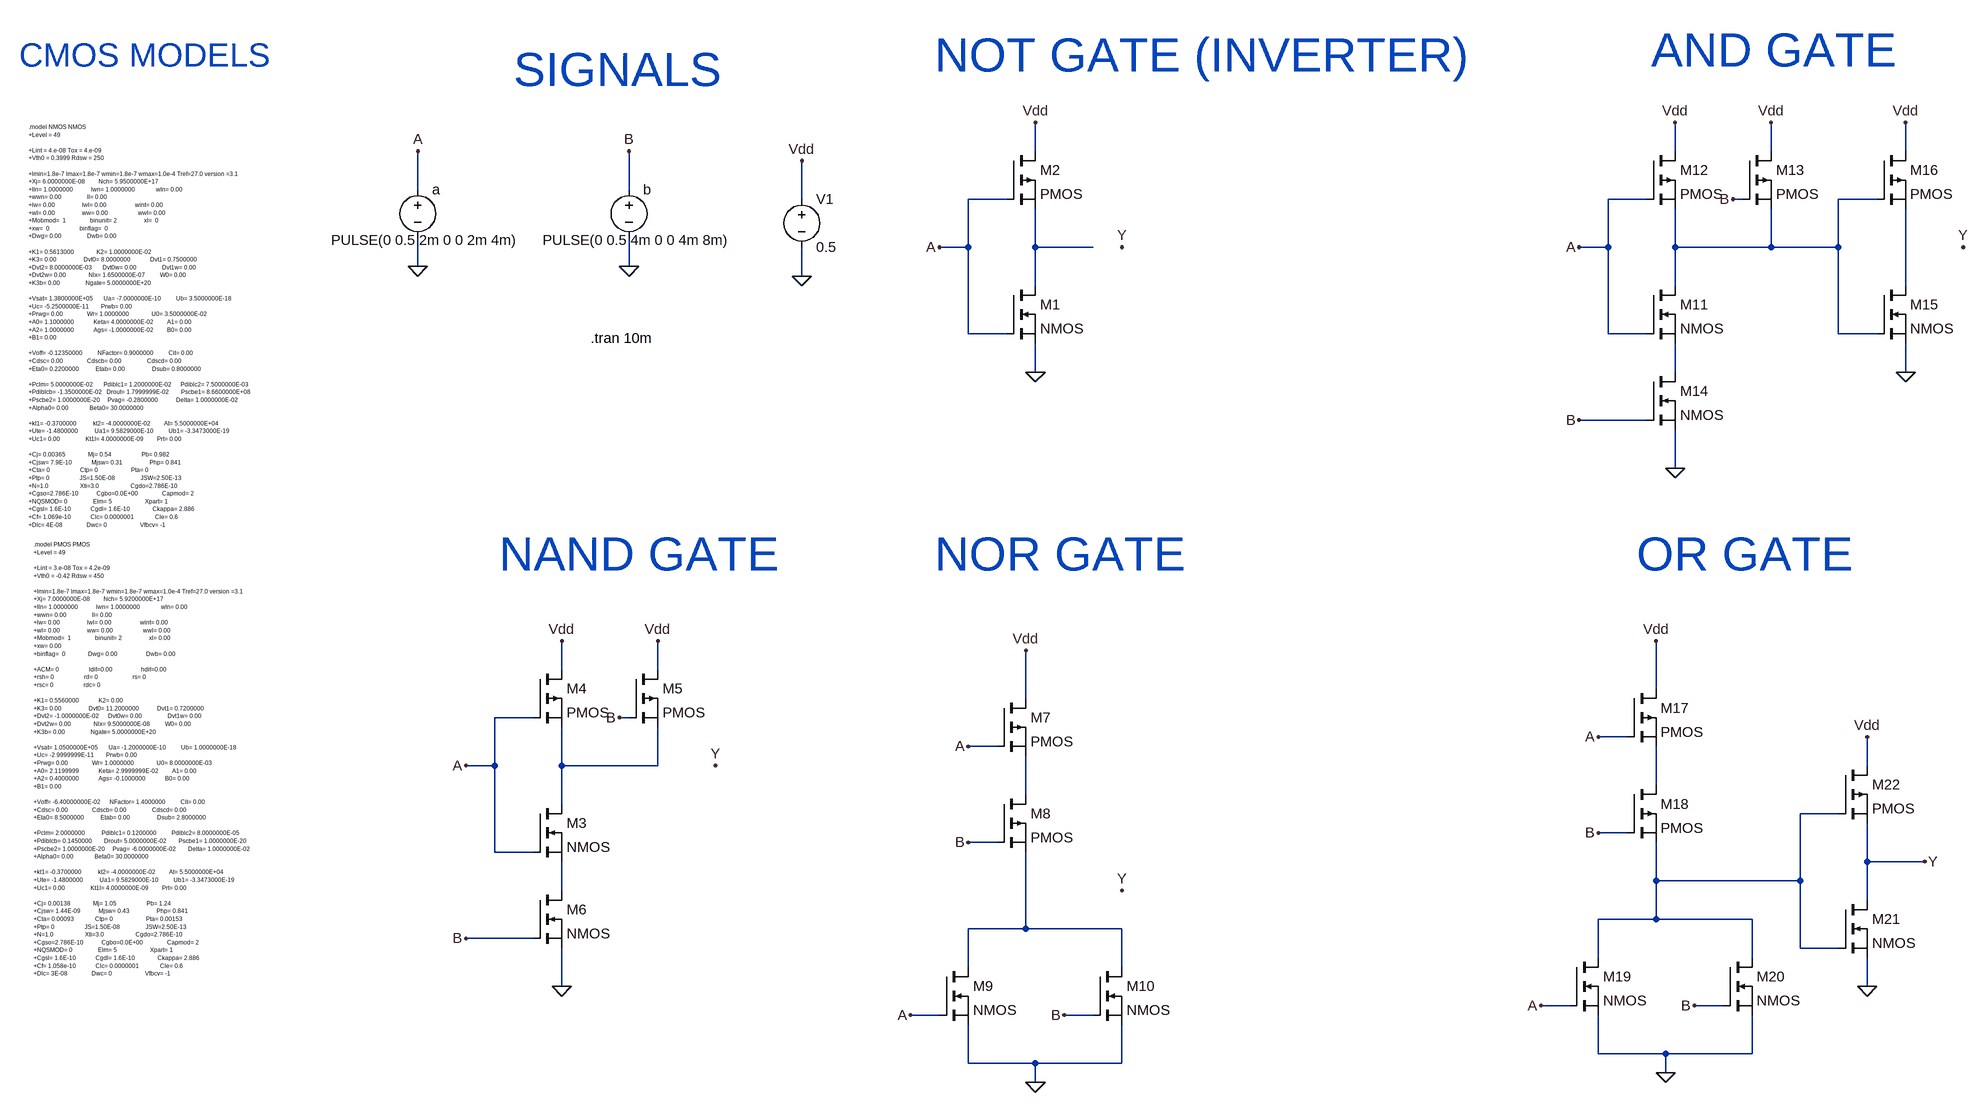
[diagram p0: schematic CMOS_Gates.asc]
CMOS_Gates.asc, the LTspice schematic file:
Version 4
SHEET 1 2392 1604
WIRE -560 -480 -560 -528
WIRE 528 -480 528 -528
WIRE 688 -480 688 -528
WIRE 912 -480 912 -528
WIRE -1696 -416 -1696 -480
WIRE -1344 -416 -1344 -480
WIRE -1056 -400 -1056 -464
WIRE -608 -400 -672 -400
WIRE 480 -400 416 -400
WIRE 640 -400 624 -400
WIRE 864 -400 800 -400
WIRE -672 -320 -672 -400
WIRE -672 -320 -720 -320
WIRE -560 -320 -560 -384
WIRE -464 -320 -560 -320
WIRE 416 -320 416 -400
WIRE 416 -320 368 -320
WIRE 528 -320 528 -384
WIRE 688 -320 688 -384
WIRE 688 -320 528 -320
WIRE 800 -320 800 -400
WIRE 800 -320 688 -320
WIRE -1696 -288 -1696 -336
WIRE -1344 -288 -1344 -336
WIRE -1056 -272 -1056 -320
WIRE -560 -256 -560 -320
WIRE 528 -256 528 -320
WIRE 912 -256 912 -384
WIRE -672 -176 -672 -320
WIRE -608 -176 -672 -176
WIRE 416 -176 416 -320
WIRE 480 -176 416 -176
WIRE 800 -176 800 -320
WIRE 864 -176 800 -176
WIRE -560 -112 -560 -160
WIRE 528 -112 528 -160
WIRE 912 -112 912 -160
WIRE 480 -32 368 -32
WIRE 528 48 528 -16
WIRE -1456 384 -1456 336
WIRE -1296 384 -1296 336
WIRE 496 416 496 336
WIRE -576 432 -576 352
WIRE -1504 464 -1568 464
WIRE -1344 464 -1360 464
WIRE 448 496 400 496
WIRE -624 512 -672 512
WIRE -1568 544 -1568 464
WIRE -1568 544 -1616 544
WIRE -1456 544 -1456 480
WIRE -1296 544 -1296 480
WIRE -1296 544 -1456 544
WIRE 848 544 848 496
WIRE 496 576 496 512
WIRE -576 592 -576 528
WIRE -1456 608 -1456 544
WIRE 800 624 736 624
WIRE 448 656 400 656
WIRE -624 672 -672 672
WIRE -1568 688 -1568 544
WIRE -1504 688 -1568 688
WIRE 848 704 848 640
WIRE 944 704 848 704
WIRE 496 736 496 672
WIRE 736 736 736 624
WIRE 736 736 496 736
WIRE -1456 752 -1456 704
WIRE 848 768 848 704
WIRE 496 800 496 736
WIRE 496 800 400 800
WIRE 656 800 496 800
WIRE -576 816 -576 688
WIRE -576 816 -672 816
WIRE -416 816 -576 816
WIRE -1504 832 -1616 832
WIRE 736 848 736 736
WIRE 800 848 736 848
WIRE 400 864 400 800
WIRE 656 864 656 800
WIRE -672 880 -672 816
WIRE -416 880 -416 816
WIRE -1456 912 -1456 848
WIRE 848 912 848 864
WIRE 352 944 304 944
WIRE 608 944 560 944
WIRE -720 960 -768 960
WIRE -464 960 -512 960
WIRE 400 1024 400 960
WIRE 512 1024 400 1024
WIRE 656 1024 656 960
WIRE 656 1024 512 1024
WIRE -672 1040 -672 976
WIRE -560 1040 -672 1040
WIRE -416 1040 -416 976
WIRE -416 1040 -560 1040
WIRE 512 1056 512 1024
WIRE -560 1072 -560 1040
FLAG -560 -112 0
FLAG -1056 -272 0
FLAG -1056 -464 Vdd
FLAG -560 -528 Vdd
FLAG -720 -320 A
FLAG -1696 -288 0
FLAG -1696 -480 A
FLAG -1456 336 Vdd
FLAG -1616 544 A
FLAG -1200 544 Y
FLAG -1456 912 0
FLAG -1296 336 Vdd
FLAG -1616 832 B
FLAG -1360 464 B
FLAG -1344 -288 0
FLAG -1344 -480 B
FLAG -416 -320 Y
FLAG -576 352 Vdd
FLAG -560 1072 0
FLAG -672 512 A
FLAG -768 960 A
FLAG -672 672 B
FLAG -512 960 B
FLAG -416 752 Y
FLAG 528 -528 Vdd
FLAG 368 -320 A
FLAG 528 48 0
FLAG 688 -528 Vdd
FLAG 368 -32 B
FLAG 624 -400 B
FLAG 912 -112 0
FLAG 912 -528 Vdd
FLAG 496 336 Vdd
FLAG 512 1056 0
FLAG 400 496 A
FLAG 304 944 A
FLAG 400 656 B
FLAG 560 944 B
FLAG 944 704 Y
FLAG 848 912 0
FLAG 848 496 Vdd
FLAG 1008 -320 Y
SYMBOL nmos -608 -256 R0
SYMATTR InstName M1
SYMATTR Value2 L=0.18u W=1.0e-4
SYMBOL pmos -608 -480 R0
SYMATTR InstName M2
SYMATTR Value2 L=0.18u W=1.0e-4
SYMBOL voltage -1056 -416 R0
WINDOW 123 0 0 Left 0
WINDOW 39 0 0 Left 0
SYMATTR InstName V1
SYMATTR Value 0.5
SYMBOL voltage -1696 -432 R0
WINDOW 3 -144 100 Left 2
WINDOW 123 0 0 Left 0
WINDOW 39 0 0 Left 0
SYMATTR Value PULSE(0 0.5 2m 0 0 2m 4m)
SYMATTR InstName a
SYMBOL nmos -1504 608 R0
SYMATTR InstName M3
SYMATTR Value2 L=0.18u W=1.0e-4
SYMBOL pmos -1504 384 R0
SYMATTR InstName M4
SYMATTR Value2 L=0.18u W=1.0e-4
SYMBOL pmos -1344 384 R0
SYMATTR InstName M5
SYMATTR Value2 L=0.18u W=1.0e-4
SYMBOL nmos -1504 752 R0
SYMATTR InstName M6
SYMATTR Value2 L=0.18u W=1.0e-4
SYMBOL voltage -1344 -432 R0
WINDOW 3 -144 100 Left 2
WINDOW 123 0 0 Left 0
WINDOW 39 0 0 Left 0
SYMATTR Value PULSE(0 0.5 4m 0 0 4m 8m)
SYMATTR InstName b
SYMBOL pmos -624 432 R0
SYMATTR InstName M7
SYMATTR Value2 L=0.18u W=1.0e-4
SYMBOL pmos -624 592 R0
SYMATTR InstName M8
SYMATTR Value2 L=0.18u W=1.0e-4
SYMBOL nmos -720 880 R0
SYMATTR InstName M9
SYMATTR Value2 L=0.18u W=1.0e-4
SYMBOL nmos -464 880 R0
SYMATTR InstName M10
SYMATTR Value2 L=0.18u W=1.0e-4
SYMBOL nmos 480 -256 R0
SYMATTR InstName M11
SYMATTR Value2 L=0.18u W=1.0e-4
SYMBOL pmos 480 -480 R0
SYMATTR InstName M12
SYMATTR Value2 L=0.18u W=1.0e-4
SYMBOL pmos 640 -480 R0
SYMATTR InstName M13
SYMATTR Value2 L=0.18u W=1.0e-4
SYMBOL nmos 480 -112 R0
SYMATTR InstName M14
SYMATTR Value2 L=0.18u W=1.0e-4
SYMBOL nmos 864 -256 R0
SYMATTR InstName M15
SYMATTR Value2 L=0.18u W=1.0e-4
SYMBOL pmos 864 -480 R0
SYMATTR InstName M16
SYMATTR Value2 L=0.18u W=1.0e-4
SYMBOL pmos 448 416 R0
SYMATTR InstName M17
SYMATTR Value2 L=0.18u W=1.0e-4
SYMBOL pmos 448 576 R0
SYMATTR InstName M18
SYMATTR Value2 L=0.18u W=1.0e-4
SYMBOL nmos 352 864 R0
SYMATTR InstName M19
SYMATTR Value2 L=0.18u W=1.0e-4
SYMBOL nmos 608 864 R0
SYMATTR InstName M20
SYMATTR Value2 L=0.18u W=1.0e-4
SYMBOL nmos 800 768 R0
SYMATTR InstName M21
SYMATTR Value2 L=0.18u W=1.0e-4
SYMBOL pmos 800 544 R0
SYMATTR InstName M22
SYMATTR Value2 L=0.18u W=1.0e-4
TEXT -1408 -168 Left 2 !.tran 10m
TEXT -2656 -520 Left 0 !.model NMOS NMOS\n+Level = 49\n \n+Lint = 4.e-08 Tox = 4.e-09 \n+Vth0 = 0.3999 Rdsw = 250 \n \n+lmin=1.8e-7 lmax=1.8e-7 wmin=1.8e-7 wmax=1.0e-4 Tref=27.0 version =3.1\n+Xj= 6.0000000E-08         Nch= 5.9500000E+17 \n+lln= 1.0000000            lwn= 1.0000000              wln= 0.00\n+wwn= 0.00                 ll= 0.00\n+lw= 0.00                  lwl= 0.00                   wint= 0.00\n+wl= 0.00                  ww= 0.00                    wwl= 0.00\n+Mobmod=  1                binunit= 2                  xl=  0\n+xw=  0                    binflag=  0\n+Dwg= 0.00                 Dwb= 0.00 \n \n+K1= 0.5613000               K2= 1.0000000E-02 \n+K3= 0.00                  Dvt0= 8.0000000             Dvt1= 0.7500000 \n+Dvt2= 8.0000000E-03       Dvt0w= 0.00                 Dvt1w= 0.00 \n+Dvt2w= 0.00               Nlx= 1.6500000E-07          W0= 0.00 \n+K3b= 0.00                 Ngate= 5.0000000E+20 \n \n+Vsat= 1.3800000E+05       Ua= -7.0000000E-10          Ub= 3.5000000E-18 \n+Uc= -5.2500000E-11        Prwb= 0.00 \n+Prwg= 0.00                Wr= 1.0000000               U0= 3.5000000E-02 \n+A0= 1.1000000             Keta= 4.0000000E-02         A1= 0.00 \n+A2= 1.0000000             Ags= -1.0000000E-02         B0= 0.00 \n+B1= 0.00 \n \n+Voff= -0.12350000          NFactor= 0.9000000          Cit= 0.00 \n+Cdsc= 0.00                Cdscb= 0.00                 Cdscd= 0.00 \n+Eta0= 0.2200000           Etab= 0.00                  Dsub= 0.8000000 \n \n+Pclm= 5.0000000E-02       Pdiblc1= 1.2000000E-02      Pdiblc2= 7.5000000E-03 \n+Pdiblcb= -1.3500000E-02   Drout= 1.7999999E-02        Pscbe1= 8.6600000E+08 \n+Pscbe2= 1.0000000E-20     Pvag= -0.2800000            Delta= 1.0000000E-02 \n+Alpha0= 0.00              Beta0= 30.0000000 \n \n+kt1= -0.3700000           kt2= -4.0000000E-02         At= 5.5000000E+04 \n+Ute= -1.4800000           Ua1= 9.5829000E-10          Ub1= -3.3473000E-19 \n+Uc1= 0.00                 Kt1l= 4.0000000E-09         Prt= 0.00 \n \n+Cj= 0.00365               Mj= 0.54                    Pb= 0.982\n+Cjsw= 7.9E-10             Mjsw= 0.31                  Php= 0.841\n+Cta= 0                    Ctp= 0                      Pta= 0\n+Ptp= 0                    JS=1.50E-08                 JSW=2.50E-13\n+N=1.0                     Xti=3.0                     Cgdo=2.786E-10\n+Cgso=2.786E-10            Cgbo=0.0E+00                Capmod= 2\n+NQSMOD= 0                 Elm= 5                      Xpart= 1\n+Cgsl= 1.6E-10             Cgdl= 1.6E-10               Ckappa= 2.886\n+Cf= 1.069e-10             Clc= 0.0000001              Cle= 0.6\n+Dlc= 4E-08                Dwc= 0                      Vfbcv= -1
TEXT -2648 176 Left 0 !.model PMOS PMOS\n+Level = 49\n \n+Lint = 3.e-08 Tox = 4.2e-09 \n+Vth0 = -0.42 Rdsw = 450 \n \n+lmin=1.8e-7 lmax=1.8e-7 wmin=1.8e-7 wmax=1.0e-4 Tref=27.0 version =3.1\n+Xj= 7.0000000E-08         Nch= 5.9200000E+17 \n+lln= 1.0000000            lwn= 1.0000000              wln= 0.00\n+wwn= 0.00                 ll= 0.00\n+lw= 0.00                  lwl= 0.00                   wint= 0.00\n+wl= 0.00                  ww= 0.00                    wwl= 0.00\n+Mobmod=  1                binunit= 2                  xl= 0.00\n+xw= 0.00                  \n+binflag=  0               Dwg= 0.00                   Dwb= 0.00 \n \n+ACM= 0                    ldif=0.00                   hdif=0.00\n+rsh= 0                    rd= 0                       rs= 0\n+rsc= 0                    rdc= 0\n \n+K1= 0.5560000             K2= 0.00 \n+K3= 0.00                  Dvt0= 11.2000000            Dvt1= 0.7200000 \n+Dvt2= -1.0000000E-02      Dvt0w= 0.00                 Dvt1w= 0.00 \n+Dvt2w= 0.00               Nlx= 9.5000000E-08          W0= 0.00 \n+K3b= 0.00                 Ngate= 5.0000000E+20 \n \n+Vsat= 1.0500000E+05       Ua= -1.2000000E-10          Ub= 1.0000000E-18 \n+Uc= -2.9999999E-11        Prwb= 0.00 \n+Prwg= 0.00                Wr= 1.0000000               U0= 8.0000000E-03 \n+A0= 2.1199999             Keta= 2.9999999E-02         A1= 0.00 \n+A2= 0.4000000             Ags= -0.1000000             B0= 0.00 \n+B1= 0.00 \n \n+Voff= -6.40000000E-02      NFactor= 1.4000000          Cit= 0.00 \n+Cdsc= 0.00                Cdscb= 0.00                 Cdscd= 0.00 \n+Eta0= 8.5000000           Etab= 0.00                  Dsub= 2.8000000 \n \n+Pclm= 2.0000000           Pdiblc1= 0.1200000          Pdiblc2= 8.0000000E-05 \n+Pdiblcb= 0.1450000        Drout= 5.0000000E-02        Pscbe1= 1.0000000E-20 \n+Pscbe2= 1.0000000E-20     Pvag= -6.0000000E-02        Delta= 1.0000000E-02 \n+Alpha0= 0.00              Beta0= 30.0000000 \n \n+kt1= -0.3700000           kt2= -4.0000000E-02         At= 5.5000000E+04 \n+Ute= -1.4800000           Ua1= 9.5829000E-10          Ub1= -3.3473000E-19 \n+Uc1= 0.00                 Kt1l= 4.0000000E-09         Prt= 0.00 \n \n+Cj= 0.00138               Mj= 1.05                    Pb= 1.24\n+Cjsw= 1.44E-09            Mjsw= 0.43                  Php= 0.841\n+Cta= 0.00093              Ctp= 0                      Pta= 0.00153\n+Ptp= 0                    JS=1.50E-08                 JSW=2.50E-13\n+N=1.0                     Xti=3.0                     Cgdo=2.786E-10\n+Cgso=2.786E-10            Cgbo=0.0E+00                Capmod= 2\n+NQSMOD= 0                 Elm= 5                      Xpart= 1\n+Cgsl= 1.6E-10             Cgdl= 1.6E-10               Ckappa= 2.886\n+Cf= 1.058e-10             Clc= 0.0000001              Cle= 0.6\n+Dlc= 3E-08                Dwc= 0                      Vfbcv= -1
TEXT -1536 -616 Left 6 ;SIGNALS
TEXT -728 -640 Left 6 ;NOT GATE (INVERTER)
TEXT -1560 192 Left 6 ;NAND GATE
TEXT -728 192 Left 6 ;NOR GATE
TEXT -2672 -640 Left 5 ;CMOS MODELS
TEXT 488 -648 Left 6 ;AND GATE
TEXT 464 192 Left 6 ;OR GATE

The netlist it stands for:
* CMOS_Gates.asc
M1 N002 A 0 0 NMOS L=0.18u W=1.0e-4
M2 Vdd A N002 N002 PMOS L=0.18u W=1.0e-4
V1 Vdd 0 0.5
V§a A 0 PULSE(0 0.5 2m 0 0 2m 4m)
M3 N005 A N009 N009 NMOS L=0.18u W=1.0e-4
M4 Vdd A N005 N005 PMOS L=0.18u W=1.0e-4
M5 Vdd B N005 N005 PMOS L=0.18u W=1.0e-4
M6 N009 B 0 0 NMOS L=0.18u W=1.0e-4
V§b B 0 PULSE(0 0.5 4m 0 0 4m 8m)
M7 Vdd A N007 N007 PMOS L=0.18u W=1.0e-4
M8 N007 B N010 N010 PMOS L=0.18u W=1.0e-4
M9 N010 A 0 0 NMOS L=0.18u W=1.0e-4
M10 N010 B 0 0 NMOS L=0.18u W=1.0e-4
M11 N001 A N004 N004 NMOS L=0.18u W=1.0e-4
M12 Vdd A N001 N001 PMOS L=0.18u W=1.0e-4
M13 Vdd B N001 N001 PMOS L=0.18u W=1.0e-4
M14 N004 B 0 0 NMOS L=0.18u W=1.0e-4
M15 N003 N001 0 0 NMOS L=0.18u W=1.0e-4
M16 Vdd N001 N003 N003 PMOS L=0.18u W=1.0e-4
M17 Vdd A N006 N006 PMOS L=0.18u W=1.0e-4
M18 N006 B N008 N008 PMOS L=0.18u W=1.0e-4
M19 N008 A 0 0 NMOS L=0.18u W=1.0e-4
M20 N008 B 0 0 NMOS L=0.18u W=1.0e-4
M21 Y N008 0 0 NMOS L=0.18u W=1.0e-4
M22 Vdd N008 Y Y PMOS L=0.18u W=1.0e-4
.model NMOS NMOS
.model PMOS PMOS
.lib standard.mos
.tran 10m
.model NMOS NMOS
+Level = 49
+Lint = 4.e-08 Tox = 4.e-09
+Vth0 = 0.3999 Rdsw = 250
+lmin=1.8e-7 lmax=1.8e-7 wmin=1.8e-7 wmax=1.0e-4 Tref=27.0 version =3.1
+Xj= 6.0000000E-08         Nch= 5.9500000E+17
+lln= 1.0000000            lwn= 1.0000000              wln= 0.00
+wwn= 0.00                 ll= 0.00
+lw= 0.00                  lwl= 0.00                   wint= 0.00
+wl= 0.00                  ww= 0.00                    wwl= 0.00
+Mobmod=  1                binunit= 2                  xl=  0
+xw=  0                    binflag=  0
+Dwg= 0.00                 Dwb= 0.00
+K1= 0.5613000               K2= 1.0000000E-02
+K3= 0.00                  Dvt0= 8.0000000             Dvt1= 0.7500000
+Dvt2= 8.0000000E-03       Dvt0w= 0.00                 Dvt1w= 0.00
+Dvt2w= 0.00               Nlx= 1.6500000E-07          W0= 0.00
+K3b= 0.00                 Ngate= 5.0000000E+20
+Vsat= 1.3800000E+05       Ua= -7.0000000E-10          Ub= 3.5000000E-18
+Uc= -5.2500000E-11        Prwb= 0.00
+Prwg= 0.00                Wr= 1.0000000               U0= 3.5000000E-02
+A0= 1.1000000             Keta= 4.0000000E-02         A1= 0.00
+A2= 1.0000000             Ags= -1.0000000E-02         B0= 0.00
+B1= 0.00
+Voff= -0.12350000          NFactor= 0.9000000          Cit= 0.00
+Cdsc= 0.00                Cdscb= 0.00                 Cdscd= 0.00
+Eta0= 0.2200000           Etab= 0.00                  Dsub= 0.8000000
+Pclm= 5.0000000E-02       Pdiblc1= 1.2000000E-02      Pdiblc2= 7.5000000E-03
+Pdiblcb= -1.3500000E-02   Drout= 1.7999999E-02        Pscbe1= 8.6600000E+08
+Pscbe2= 1.0000000E-20     Pvag= -0.2800000            Delta= 1.0000000E-02
+Alpha0= 0.00              Beta0= 30.0000000
+kt1= -0.3700000           kt2= -4.0000000E-02         At= 5.5000000E+04
+Ute= -1.4800000           Ua1= 9.5829000E-10          Ub1= -3.3473000E-19
+Uc1= 0.00                 Kt1l= 4.0000000E-09         Prt= 0.00
+Cj= 0.00365               Mj= 0.54                    Pb= 0.982
+Cjsw= 7.9E-10             Mjsw= 0.31                  Php= 0.841
+Cta= 0                    Ctp= 0                      Pta= 0
+Ptp= 0                    JS=1.50E-08                 JSW=2.50E-13
+N=1.0                     Xti=3.0                     Cgdo=2.786E-10
+Cgso=2.786E-10            Cgbo=0.0E+00                Capmod= 2
+NQSMOD= 0                 Elm= 5                      Xpart= 1
+Cgsl= 1.6E-10             Cgdl= 1.6E-10               Ckappa= 2.886
+Cf= 1.069e-10             Clc= 0.0000001              Cle= 0.6
+Dlc= 4E-08                Dwc= 0                      Vfbcv= -1
.model PMOS PMOS
+Level = 49
+Lint = 3.e-08 Tox = 4.2e-09
+Vth0 = -0.42 Rdsw = 450
+lmin=1.8e-7 lmax=1.8e-7 wmin=1.8e-7 wmax=1.0e-4 Tref=27.0 version =3.1
+Xj= 7.0000000E-08         Nch= 5.9200000E+17
+lln= 1.0000000            lwn= 1.0000000              wln= 0.00
+wwn= 0.00                 ll= 0.00
+lw= 0.00                  lwl= 0.00                   wint= 0.00
+wl= 0.00                  ww= 0.00                    wwl= 0.00
+Mobmod=  1                binunit= 2                  xl= 0.00
+xw= 0.00
+binflag=  0               Dwg= 0.00                   Dwb= 0.00
+ACM= 0                    ldif=0.00                   hdif=0.00
+rsh= 0                    rd= 0                       rs= 0
+rsc= 0                    rdc= 0
+K1= 0.5560000             K2= 0.00
+K3= 0.00                  Dvt0= 11.2000000            Dvt1= 0.7200000
+Dvt2= -1.0000000E-02      Dvt0w= 0.00                 Dvt1w= 0.00
+Dvt2w= 0.00               Nlx= 9.5000000E-08          W0= 0.00
+K3b= 0.00                 Ngate= 5.0000000E+20
+Vsat= 1.0500000E+05       Ua= -1.2000000E-10          Ub= 1.0000000E-18
+Uc= -2.9999999E-11        Prwb= 0.00
+Prwg= 0.00                Wr= 1.0000000               U0= 8.0000000E-03
+A0= 2.1199999             Keta= 2.9999999E-02         A1= 0.00
+A2= 0.4000000             Ags= -0.1000000             B0= 0.00
+B1= 0.00
+Voff= -6.40000000E-02      NFactor= 1.4000000          Cit= 0.00
+Cdsc= 0.00                Cdscb= 0.00                 Cdscd= 0.00
+Eta0= 8.5000000           Etab= 0.00                  Dsub= 2.8000000
+Pclm= 2.0000000           Pdiblc1= 0.1200000          Pdiblc2= 8.0000000E-05
+Pdiblcb= 0.1450000        Drout= 5.0000000E-02        Pscbe1= 1.0000000E-20
+Pscbe2= 1.0000000E-20     Pvag= -6.0000000E-02        Delta= 1.0000000E-02
+Alpha0= 0.00              Beta0= 30.0000000
+kt1= -0.3700000           kt2= -4.0000000E-02         At= 5.5000000E+04
+Ute= -1.4800000           Ua1= 9.5829000E-10          Ub1= -3.3473000E-19
+Uc1= 0.00                 Kt1l= 4.0000000E-09         Prt= 0.00
+Cj= 0.00138               Mj= 1.05                    Pb= 1.24
+Cjsw= 1.44E-09            Mjsw= 0.43                  Php= 0.841
+Cta= 0.00093              Ctp= 0                      Pta= 0.00153
+Ptp= 0                    JS=1.50E-08                 JSW=2.50E-13
+N=1.0                     Xti=3.0                     Cgdo=2.786E-10
+Cgso=2.786E-10            Cgbo=0.0E+00                Capmod= 2
+NQSMOD= 0                 Elm= 5                      Xpart= 1
+Cgsl= 1.6E-10             Cgdl= 1.6E-10               Ckappa= 2.886
+Cf= 1.058e-10             Clc= 0.0000001              Cle= 0.6
+Dlc= 3E-08                Dwc= 0                      Vfbcv= -1
* SIGNALS
* NOT GATE (INVERTER)
* NAND GATE
* NOR GATE
* CMOS MODELS
* AND GATE
* OR GATE
.backanno
.end